# Altium project Ser.PrjPCB
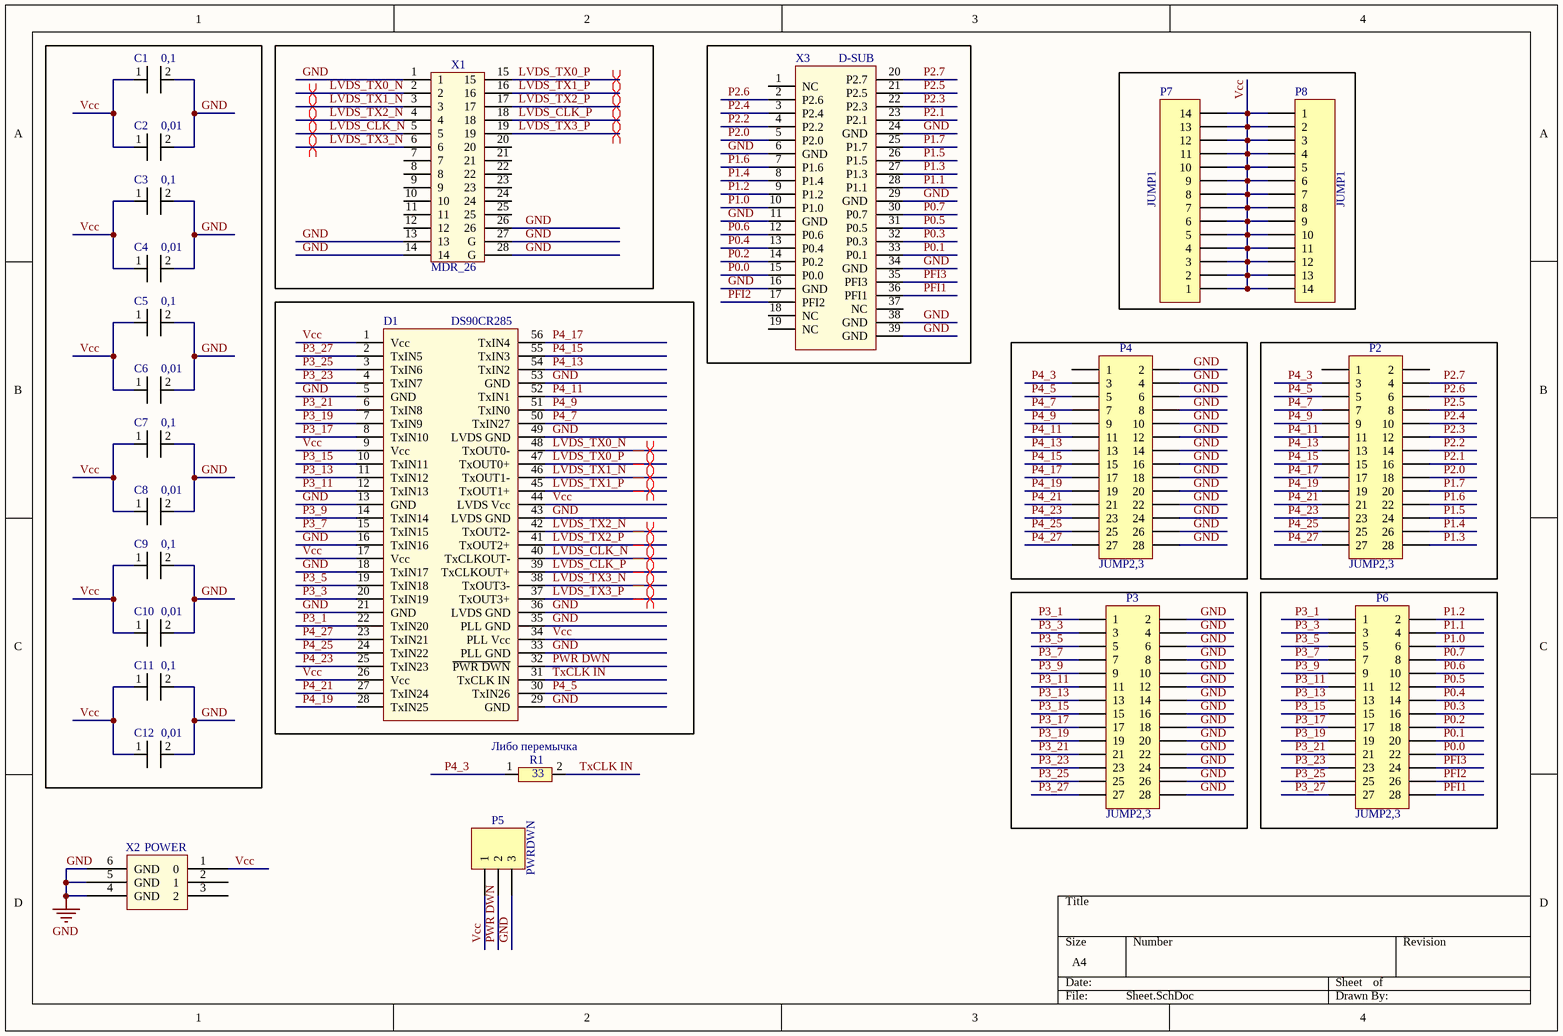
[diagram p0: Sheet.SchDoc]
1 sheet, 24 parts. Net scope: global (net labels, ports and power ports of the same name join across sheets).
Board file: PCB.PcbDoc

## Sheet Sheet.SchDoc
size A4

### Parts
C1  0,1  [CAP_SMALL]
C2  0,01  [CAP_SMALL]
C3  0,1  [CAP_SMALL]
C4  0,01  [CAP_SMALL]
C5  0,1  [CAP_SMALL]
C6  0,01  [CAP_SMALL]
C7  0,1  [CAP_SMALL]
C8  0,01  [CAP_SMALL]
C9  0,1  [CAP_SMALL]
C10  0,01  [CAP_SMALL]
C11  0,1  [CAP_SMALL]
C12  0,01  [CAP_SMALL]
D1  DS90CR285  [TSSOP56]
P2  JUMP2,3  [HDR2X14]
P3  JUMP2,3  [HDR2X14]
P4  JUMP2,3  [HDR2X14]
P5  PWRDWN  [HDR1X3]
P6  JUMP2,3  [HDR2X14]
P7  JUMP1  [HDR1X14]
P8  JUMP1  [HDR1X14]
R1  33  [RES]
X1  MDR_26  [MDR26]
X2  POWER  [POWER]
X3  D-SUB  [CHEAP_CONN_FEMALE]

### Nets
GND: C1.2 C2.2 C3.2 C4.2 C5.2 C6.2 C7.2 C8.2 C9.2 C10.2 C11.2 C12.2 D1.5(GND) D1.13(GND) D1.16(TxIN16) D1.18(TxIN17) D1.21(GND) D1.29(GND) D1.33(PLL_GND) D1.35(PLL_GND) D1.36(LVDS_GND) D1.43(LVDS_GND) D1.49(LVDS_GND) D1.53(GND) P3.2 P3.4 P3.6 P3.8 P3.10 P3.12 P3.14 P3.16 P3.18 P3.20 P3.22 P3.24 P3.26 P3.28 P4.2 P4.4 P4.6 P4.8 P4.10 P4.12 P4.14 P4.16 P4.18 P4.20 P4.22 P4.24 P4.26 P4.28 P5.3 X1.1 X1.13 X1.14 X1.26 X1.27(G) X1.28(G) X2.4(GND) X2.5(GND) X2.6(GND) X3.6(GND) X3.11(GND) X3.16(GND) X3.24(GND) X3.29(GND) X3.34(GND) X3.38(GND) X3.39(GND)
LVDS_CLK_N: D1.40(TxCLKOUT-) X1.5
LVDS_CLK_P: D1.39(TxCLKOUT+) X1.18
LVDS_TX0_N: D1.48(TxOUT0-) X1.2
LVDS_TX0_P: D1.47(TxOUT0+) X1.15
LVDS_TX1_N: D1.46(TxOUT1-) X1.3
LVDS_TX1_P: D1.45(TxOUT1+) X1.16
LVDS_TX2_N: D1.42(TxOUT2-) X1.4
LVDS_TX2_P: D1.41(TxOUT2+) X1.17
LVDS_TX3_N: D1.38(TxOUT3-) X1.6
LVDS_TX3_P: D1.37(TxOUT3+) X1.19
P0.0: P6.22 X3.15(P0.0)
P0.1: P6.20 X3.33(P0.1)
P0.2: P6.18 X3.14(P0.2)
P0.3: P6.16 X3.32(P0.3)
P0.4: P6.14 X3.13(P0.4)
P0.5: P6.12 X3.31(P0.5)
P0.6: P6.10 X3.12(P0.6)
P0.7: P6.8 X3.30(P0.7)
P1.0: P6.6 X3.10(P1.0)
P1.1: P6.4 X3.28(P1.1)
P1.2: P6.2 X3.9(P1.2)
P1.3: P2.28 X3.27(P1.3)
P1.4: P2.26 X3.8(P1.4)
P1.5: P2.24 X3.26(P1.5)
P1.6: P2.22 X3.7(P1.6)
P1.7: P2.20 X3.25(P1.7)
P2.0: P2.18 X3.5(P2.0)
P2.1: P2.16 X3.23(P2.1)
P2.2: P2.14 X3.4(P2.2)
P2.3: P2.12 X3.22(P2.3)
P2.4: P2.10 X3.3(P2.4)
P2.5: P2.8 X3.21(P2.5)
P2.6: P2.6 X3.2(P2.6)
P2.7: P2.4 X3.20(P2.7)
P3_1: D1.22(TxIN20) P3.1 P6.1
P3_3: D1.20(TxIN19) P3.3 P6.3
P3_5: D1.19(TxIN18) P3.5 P6.5
P3_7: D1.15(TxIN15) P3.7 P6.7
P3_9: D1.14(TxIN14) P3.9 P6.9
P3_11: D1.12(TxIN13) P3.11 P6.11
P3_13: D1.11(TxIN12) P3.13 P6.13
P3_15: D1.10(TxIN11) P3.15 P6.15
P3_17: D1.8(TxIN10) P3.17 P6.17
P3_19: D1.7(TxIN9) P3.19 P6.19
P3_21: D1.6(TxIN8) P3.21 P6.21
P3_23: D1.4(TxIN7) P3.23 P6.23
P3_25: D1.3(TxIN6) P3.25 P6.25
P3_27: D1.2(TxIN5) P3.27 P6.27
P4_3: P2.3 P4.3 R1.1
P4_5: D1.30(TxIN26) P2.5 P4.5
P4_7: D1.50(TxIN27) P2.7 P4.7
P4_9: D1.51(TxIN0) P2.9 P4.9
P4_11: D1.52(TxIN1) P2.11 P4.11
P4_13: D1.54(TxIN2) P2.13 P4.13
P4_15: D1.55(TxIN3) P2.15 P4.15
P4_17: D1.56(TxIN4) P2.17 P4.17
P4_19: D1.28(TxIN25) P2.19 P4.19
P4_21: D1.27(TxIN24) P2.21 P4.21
P4_23: D1.25(TxIN23) P2.23 P4.23
P4_25: D1.24(TxIN22) P2.25 P4.25
P4_27: D1.23(TxIN21) P2.27 P4.27
PFI1: P6.28 X3.36(PFI1)
PFI2: P6.26 X3.17(PFI2)
PFI3: P6.24 X3.35(PFI3)
PWR DWN: D1.32(~{PWR_DWN}) P5.2
TxCLK IN: D1.31(TxCLK_IN) R1.2
Vcc: C1.1 C2.1 C3.1 C4.1 C5.1 C6.1 C7.1 C8.1 C9.1 C10.1 C11.1 C12.1 D1.1(Vcc) D1.9(Vcc) D1.17(Vcc) D1.26(Vcc) D1.34(PLL_Vcc) D1.44(LVDS_Vcc) P5.1 P7.1 P7.2 P7.3 P7.4 P7.5 P7.6 P7.7 P7.8 P7.9 P7.10 P7.11 P7.12 P7.13 P7.14 P8.1 P8.2 P8.3 P8.4 P8.5 P8.6 P8.7 P8.8 P8.9 P8.10 P8.11 P8.12 P8.13 P8.14 X2.1(0)

Not connected (* = marked no-connect by the designer): P2 1 2; P4 1; X1 7 8 9 10 11 12 20 21 22 23 24 25; X2 2(1) 3(2); X3 1(NC) 18(NC) 19(NC) 37(NC)

### Layout directives
differential pair: LVDS_CLK_N, LVDS_CLK_P, LVDS_TX0_N, LVDS_TX0_P, LVDS_TX1_N, LVDS_TX1_P, LVDS_TX2_N, LVDS_TX2_P, LVDS_TX3_N, LVDS_TX3_P

### Notes on the sheet
- Либо перемычка

### Library data of the parts
C1-C12 = CAP_SMALL
P2-P4 P6 = Header 14X2: Header, 14-Pin, Dual row; LatestRevisionDate: 17-Jul-2002; LatestRevisionNote: Re-released for DXP Platform.; Publisher: Altium Limited
P5 = Header 3: Header, 3-Pin; LatestRevisionDate: 17-Jul-2002; LatestRevisionNote: Re-released for DXP Platform.; Publisher: Altium Limited
P7 P8 = Header 14: Header, 14-Pin; LatestRevisionDate: 17-Jul-2002; LatestRevisionNote: Re-released for DXP Platform.; Publisher: Altium Limited
R1 = RES
X3 = CHEAP_CON_37_FEMALE